# EAGLE schematic UOF_proto_2V4 (EAGLE 9.5.2)
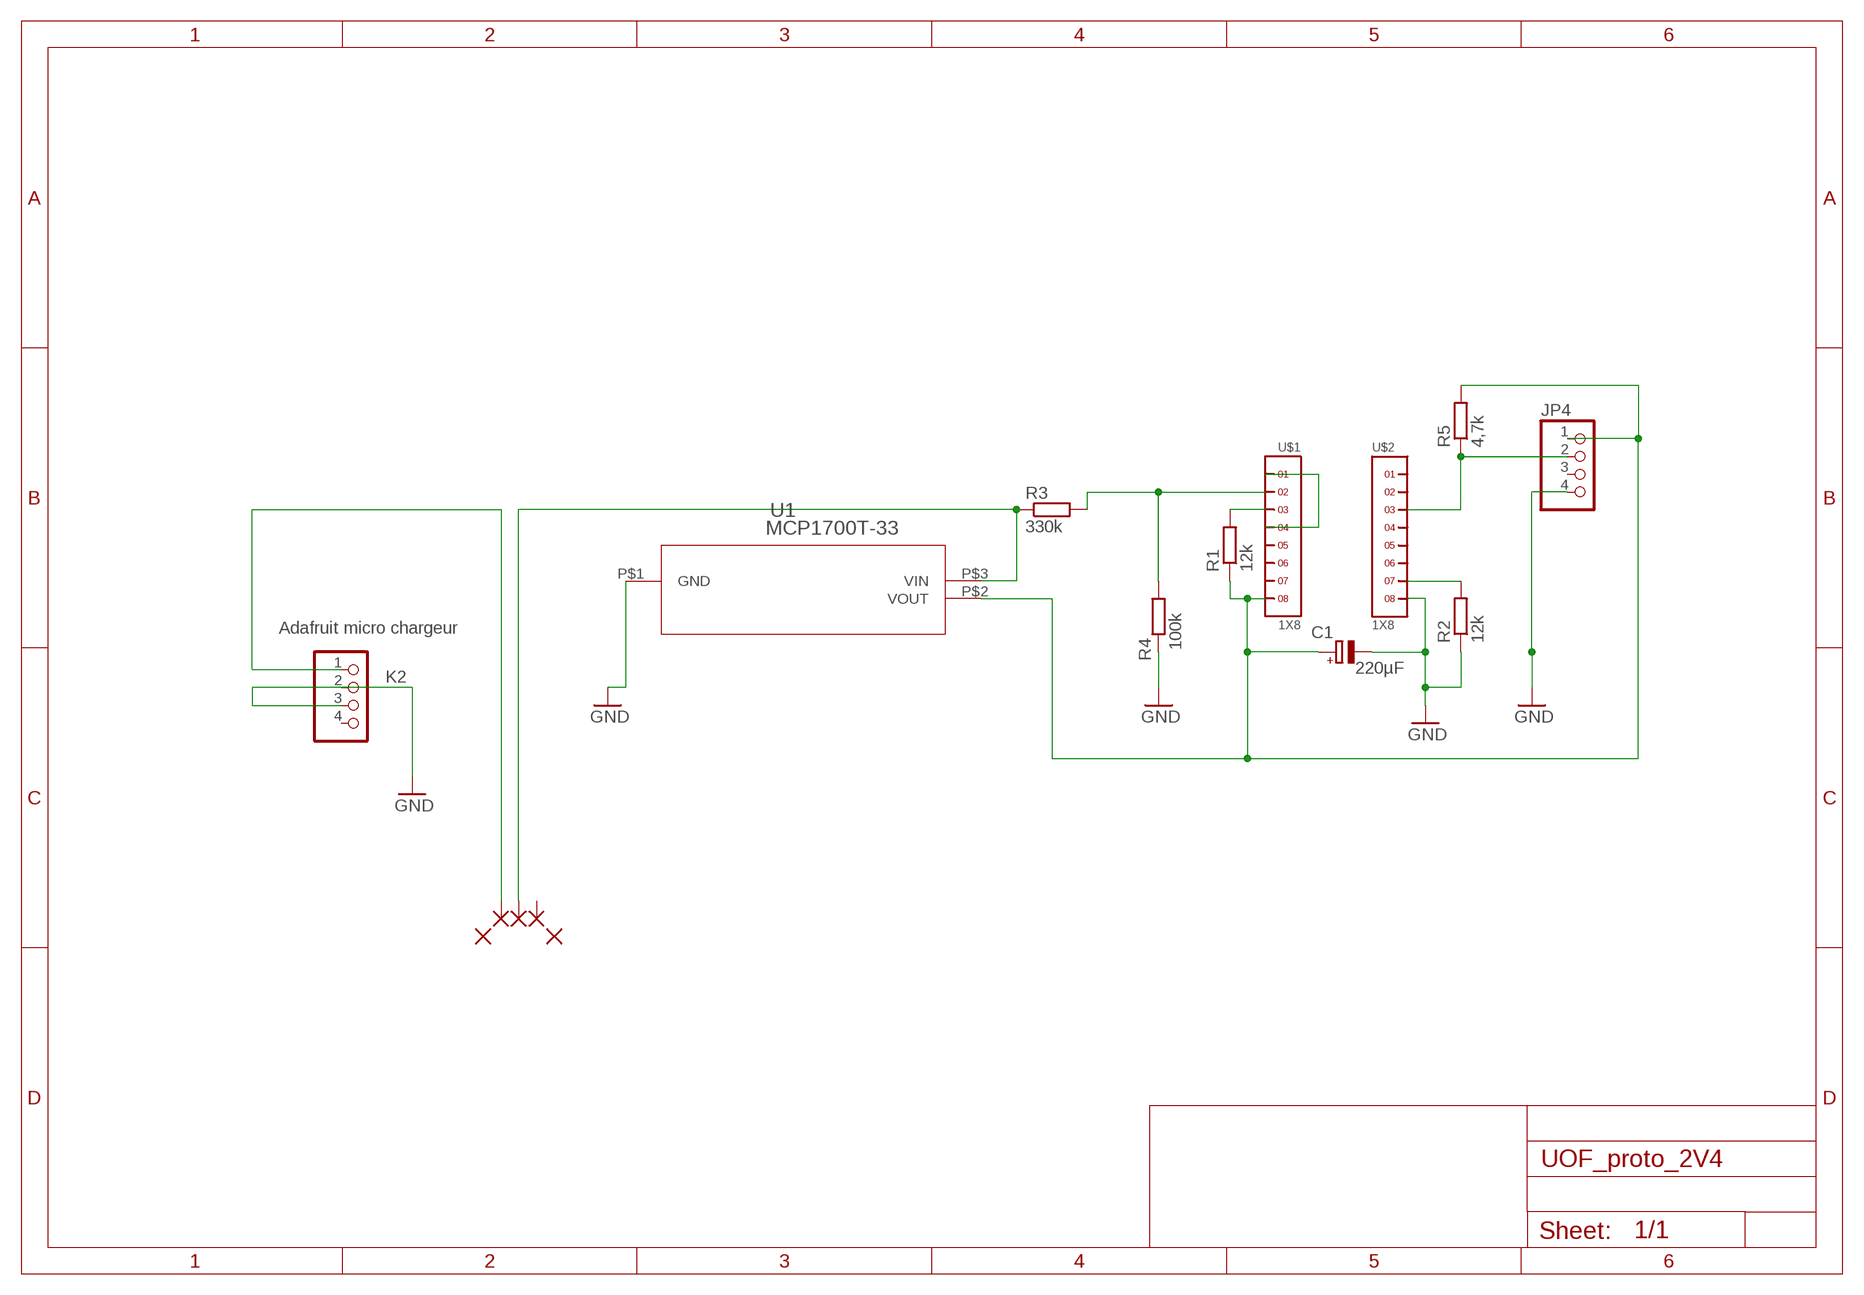
[diagram p0: schematic, sheet 1]

## Parts
C1  220µF  CPOL-EUE5-10.5  [E5-10,5]
JP4  PINHD-1X4  [1X04]
K2  Adafruit micro chargeur  PINHD-1X4  [1X04]
PAD1  1,6/0,8  [1,6/0,8]
PAD2  1,6/0,8  [1,6/0,8]
PAD3  1,6/0,8  [1,6/0,8]
PAD4  N_2,0/1,5  [2,0/1,5]
PAD5  N_2,0/1,5  [2,0/1,5]
R1  12k  R-EU_0207/10  [0207/10]
R2  12k  R-EU_0207/10  [0207/10]
R3  330k  R-EU_0207/10  [0207/10]
R4  100k  R-EU_0207/10  [0207/10]
R5  4,7k  R-EU_0204/2V  [0204V]
U1  MCP1700T-33  MCP1700T-3302E/TTSOT-23  [SOT-23]
U$1  1X8  [1X8]
U$2  1X8  [1X8]

## Nets
GND: C1.- JP4.4 K2.2 K2.3 R2.1 R4.2 U1.P$1(GND) U$2.8
N$2: R3.2 R4.1 U$1.2
N$3: K2.1 PAD1.1(P)
N$4: R2.2 U$2.7
N$5: C1.+ JP4.1 R1.1 R5.2 U1.P$2(VOUT) U$1.8
N$7: U$1.1 U$1.4
N$8: PAD2.1(P) R3.1 U1.P$3(VIN)
N$9: R1.2 U$1.3
N$14: JP4.2 R5.1 U$2.3
Unconnected: JP4.3 K2.4 PAD3.1(P) U$1.5 U$1.6 U$1.7 U$2.1 U$2.2 U$2.4 U$2.5 U$2.6

## Library data of the parts
C1 = rcl:CPOL-EU: POLARIZED CAPACITOR, European symbol; SPICEPREFIX: C
JP4 = _MCL_pinhead:PINHD-1X4: PIN HEADER
K2 = pinhead:PINHD-1X4: PIN HEADER
PAD1-PAD3 = _MCL_PADS:1,6/0,8
PAD4 PAD5 = _MCL_PADS:N_2,0/1,5
R1-R5 = rcl:R-EU_: RESISTOR, European symbol; SPICEPREFIX: R
U1 = MCP1700T-3302E:MCP1700T-3302E/TT
U$1 U$2 = headers(2mm):1X8

## Net classes
0 default: width 0.508 mm, clearance 0.508 mm